# EAGLE schematic USBMASS (EAGLE 5.06)
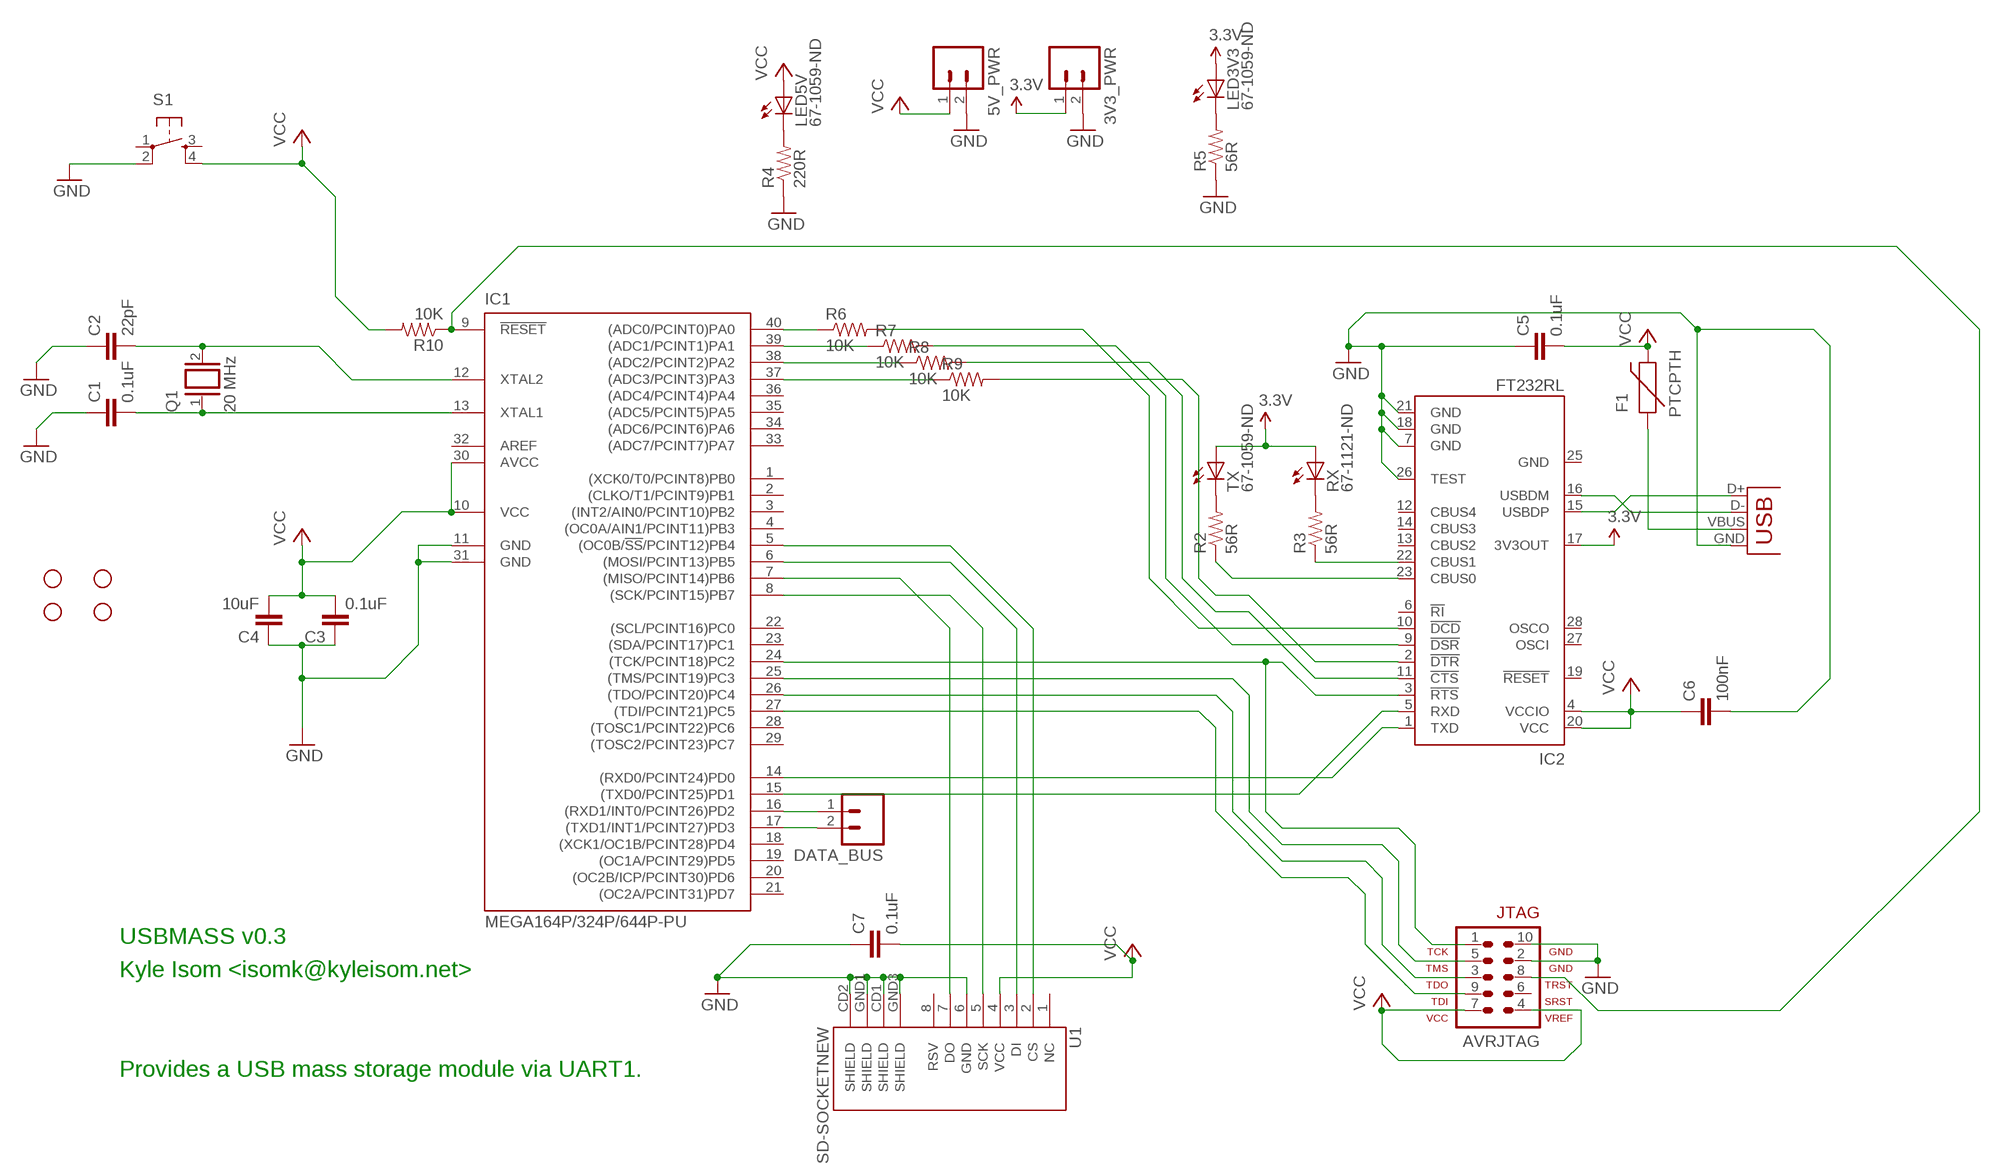
[diagram p0: schematic, sheet 1]

## Parts
3V3_PWR  M02POLAR_LOCK  [MOLEX-1X2_LOCK]
5V_PWR  M02POLAR_LOCK  [MOLEX-1X2_LOCK]
AVRJTAG  AVR-JTAG-10  [AVR-JTAG-10]
C1  0.1uF  CAPPTH1  [CAP-PTH-5MM]
C2  22pF  CAPPTH1  [CAP-PTH-5MM]
C3  0.1uF  CAPPTH1  [CAP-PTH-5MM]
C4  10uF  CAPPTH1  [CAP-PTH-5MM]
C5  0.1uF  CAPPTH1  [CAP-PTH-5MM]
C6  100nF  CAPPTH1  [CAP-PTH-5MM]
C7  0.1uF  CAPPTH1  [CAP-PTH-5MM]
DATA_BUS  M02LOCK  [1X02_LOCK]
F1  PTCPTH  [PTC]
IC1  MEGA164P/324P/644P-PU  [DIL40]
IC2  FT232RL  [SSOP28]
JP1  STAND-OFF  [STAND-OFF]
JP2  STAND-OFF  [STAND-OFF]
JP3  STAND-OFF  [STAND-OFF]
JP4  STAND-OFF  [STAND-OFF]
LED3V3  67-1059-ND  LED5MM  [LED5MM]
LED5V  67-1059-ND  LED5MM  [LED5MM]
Q1  20 MHz  XTAL/S  [QS]
R2  56R  RESISTORPTH1  [AXIAL-0.3]
R3  56R  RESISTORPTH1  [AXIAL-0.3]
R4  220R  RESISTORPTH1  [AXIAL-0.3]
R5  56R  RESISTORPTH1  [AXIAL-0.3]
R6  10K  RESISTORPTH1  [AXIAL-0.3]
R7  10K  RESISTORPTH1  [AXIAL-0.3]
R8  10K  RESISTORPTH1  [AXIAL-0.3]
R9  10K  RESISTORPTH1  [AXIAL-0.3]
R10  10K  RESISTORPTH1  [AXIAL-0.3]
RX  67-1121-ND  LED5MM  [LED5MM]
S1  TAC_SWITCH12MM  [TACTILE-PTH-12MM]
TX  67-1059-ND  LED5MM  [LED5MM]
U1  USD-SOCKETNEW  [MICRO-SD-SOCKET-PP]
X2  USBSMD  [USB-MINIB]

## Nets
3.3V: 3V3_PWR.1 IC2.17(3V3OUT) LED3V3.A RX.A TX.A
GND: 3V3_PWR.2 5V_PWR.2 AVRJTAG.2 AVRJTAG.10 C1.1 C2.1 C3.1 C4.1 C5.1 C6.2 C7.1 IC1.11(GND) IC1.31(GND) IC2.7(GND) IC2.18(GND) IC2.21(GND) IC2.26(TEST) R4.P$1 R5.P$1 S1.2 U1.6(GND) U1.CD1(SHIELD) U1.CD2(SHIELD) U1.GND1(SHIELD) U1.GND3(SHIELD) X2.GND
N$1: AVRJTAG.1 IC1.24((TCK/PCINT18)PC2) IC2.3(!RTS)
N$2: AVRJTAG.8 IC1.9(!RESET) R10.P$1
N$3: C2.2 IC1.12(XTAL2) Q1.2
N$4: C1.2 IC1.13(XTAL1) Q1.1
N$5: R2.P$2 TX.K(C)
N$6: R3.P$2 RX.K(C)
N$7: F1.P$1 X2.VBUS
N$8: IC2.16(USBDM) X2.D-
N$9: IC2.15(USBDP) X2.D+
N$10: IC2.22(CBUS1) R3.P$1
N$11: IC2.23(CBUS0) R2.P$1
N$12: LED5V.K(C) R4.P$2
N$13: LED3V3.K(C) R5.P$2
N$14: IC1.14((RXD0/PCINT24)PD0) IC2.1(TXD)
N$15: IC1.15((TXD0/PCINT25)PD1) IC2.5(RXD)
N$16: IC2.2(!DTR) R9.P$2
N$17: IC1.37((ADC3/PCINT3)PA3) R9.P$1
N$18: IC1.38((ADC2/PCINT2)PA2) R8.P$1
N$19: IC1.39((ADC1/PCINT1)PA1) R7.P$1
N$20: IC1.40((ADC0/PCINT0)PA0) R6.P$1
N$21: IC2.11(!CTS) R8.P$2
N$22: IC2.9(!DSR) R7.P$2
N$23: IC2.10(!DCD) R6.P$2
N$24: IC1.8((SCK/PCINT15)PB7) U1.5(SCK)
N$25: IC1.7((MISO/PCINT14)PB6) U1.7(DO)
N$26: IC1.6((MOSI/PCINT13)PB5) U1.3(DI)
N$27: IC1.5((OC0B/!SS!/PCINT12)PB4) U1.2(CS)
N$28: DATA_BUS.1 IC1.16((RXD1/INT0/PCINT26)PD2)
N$29: DATA_BUS.2 IC1.17((TXD1/INT1/PCINT27)PD3)
N$30: AVRJTAG.5 IC1.25((TMS/PCINT19)PC3)
N$31: AVRJTAG.3 IC1.26((TDO/PCINT20)PC4)
N$32: AVRJTAG.9 IC1.27((TDI/PCINT21)PC5)
VCC: 5V_PWR.1 AVRJTAG.4 AVRJTAG.7 C3.2 C4.2 C5.2 C6.1 C7.2 F1.P$2 IC1.10(VCC) IC1.30(AVCC) IC2.4(VCCIO) IC2.20(VCC) LED5V.A R10.P$2 S1.4 U1.4(VCC)
Unconnected: AVRJTAG.6 IC1.1((XCK0/T0/PCINT8)PB0) IC1.2((CLKO/T1/PCINT9)PB1) IC1.3((INT2/AIN0/PCINT10)PB2) IC1.4((OC0A/AIN1/PCINT11)PB3) IC1.18((XCK1/OC1B/PCINT28)PD4) IC1.19((OC1A/PCINT29)PD5) IC1.20((OC2B/ICP/PCINT30)PD6) IC1.21((OC2A/PCINT31)PD7) IC1.22((SCL/PCINT16)PC0) IC1.23((SDA/PCINT17)PC1) IC1.28((TOSC1/PCINT22)PC6) IC1.29((TOSC2/PCINT23)PC7) IC1.33((ADC7/PCINT7)PA7) IC1.34((ADC6/PCINT6)PA6) IC1.35((ADC5/PCINT5)PA5) IC1.36((ADC4/PCINT4)PA4) IC2.6(!RI) IC2.12(CBUS4) IC2.13(CBUS2) IC2.14(CBUS3) IC2.19(!RESET) IC2.27(OSCI) IC2.28(OSCO) S1.1 S1.3 U1.1(NC) U1.8(RSV)

## Notes on the sheet
- USBMASS v0.3
- Kyle Isom <isomk@kyleisom.net>
- Provides a USB mass storage module via UART1.

## Power pins joined to a net without a drawn wire
AREF: IC1.32(AREF)
GND: IC2.25(GND)

## Library data of the parts
3V3_PWR 5V_PWR DATA_BUS = SparkFun:M02: Header 2 Standard 2-pin 0.1" header. Use with straight break away headers (SKU : PRT-00116), right angle break away headers (PRT-00553), swiss pins (PRT-00743), machine pins (PRT-00117), and female headers (PRT-00115). Molex polarized connector foot print use with SKU : PRT-08233 with associated crimp pins and housings.
AVRJTAG = avr-6:AVR-JTAG-10: AVR JTAG Debug/Programming Header
C1-C7 = SparkFun:CAP: Capacitor Standard 0603 ceramic capacitor, and 0.1" leaded capacitor.
F1 = SparkFun:PTC: Resettable Fuse PTC Resettable Fuse. Spark Fun Electronics SKU : COM-08357
IC1 = avr-6:MEGA164P/324P/644P-PU
IC2 = ftdichip:FT232R: Source: http://www.ftdichip.com/Documents/DataSheets/DS_FT232R_v104.pdf
JP1-JP4 = SparkFun:STAND-OFF: Stand Off This is the mechanical footprint for a #4 phillips button head screw. Use the keepout ring to avoid running the screw head into surrounding components. SKU : PRT-00447
LED3V3 LED5V RX TX = SparkFun:LED: LEDs Standard schematic elements and footprints for 5mm, 3mm, 1206, and 0603 sized LEDs. 5mm - Spark Fun Electronics SKU : COM-00529 (and others)
Q1 = special:XTAL/S: CRYSTAL
R2-R10 = SparkFun:RESISTOR: Resistor Basic schematic elements and footprints for 0603, 1206, and PTH 1/10th watt (small) resistors.
S1 = SparkFun:TAC_SWITCH: Momentary Switch Button commonly used for reset or general input. Spark Fun Electronics SKU : COM-00097
U1 = SparkFun:USD-SOCKET: microSD Socket Push-push type uSD socket. Schematic element and footprint production proven. Spark Fun Electronics SKU : PRT-00127. tDoc lines correctly indicate media card edge positions when inserting (unlocked, locked, depressed).
X2 = SparkFun:USB: USB Connectors USB-B-PTH is fully proven SKU : PRT-00139 USB-miniB is fully proven SKU : PRT-00587 USB-A-PCB is untested. USB-A-H is throughly reviewed, but untested. Spark Fun Electronics SKU : PRT-00437 USB-B-SMT is throughly reviewed, but untested. Needs silkscreen touching up. USB-A-S has not been used/tested USB-MB-H has not been used/tested